# EAGLE design main (EAGLE 9.3.0)
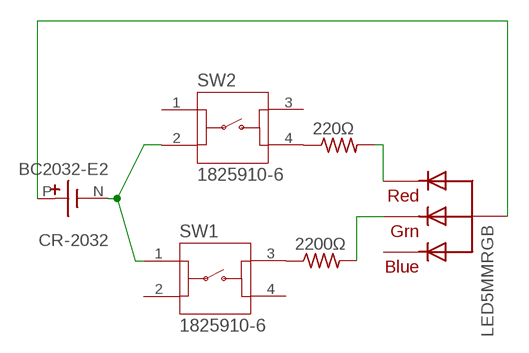
[diagram p0: schematic, sheet 1]

## Parts
220Ω  R-US_0204/5  [0204/5]
2200Ω  R-US_0204/5  [0204/5]
CR-2032  BC2032-E2  [MPD_BC2032-E2]
LED5MMRGB  RGBLED_CA-5MM  [LED5MMRGB]
SW1  1825910-6  [SW_1825910-6-4]
SW2  1825910-6  [SW_1825910-6-4]

## Nets
N$1: CR-2032.N SW1.1 SW2.2
N$2: 2200Ω.1 SW1.3
N$3: 220Ω.1 SW2.4
N$4: 2200Ω.2 LED5MMRGB.3(GREEN)
N$5: 220Ω.2 LED5MMRGB.1(RED)
N$6: CR-2032.P LED5MMRGB.2(VCC)
Unconnected: LED5MMRGB.4(BLUE) SW1.2 SW1.4 SW2.1 SW2.3

## Library data of the parts
220Ω 2200Ω = adafruit:R-US_: RESISTOR, American symbol
CR-2032 = BC2032-E2:BC2032-E2: Holder Battery Cr2032 Sony Equal; DESCRIPTION: Holder Battery Cr2032 Sony Equal; DIGI-KEY_PART_NUMBER: BC2032-E2-ND; DIGI-KEY_PURCHASE_URL: https://www.digikey.com/product-detail/en/mpd-memory-protection-devices/BC2032-E2/BC2032-E2-ND/2077836?utm_source=snapeda&utm_medium=aggregator&utm_campaign=symbol; MF: MPD _Memory; MP: BC2032-E2; PACKAGE: DFN-8 Memory Protection Devices
LED5MMRGB = adafruit:RGBLED_CA: RGB LED, common-anode 5MM Staggered pins 5mm Piranha package http://www.ladyada.net/library/pcb/eaglelibrary.html
SW1 SW2 = 1825910-6:1825910-6: Switch Tactile OFF (ON) SPST Round Button PC Pins 0.05A 24VDC 100000Cycles 1.57N Thru-Hole Loose; COMMENT: 1825910-6; CONFIGURATION_POLE-THROW: Single Pole - Single Throw; CONTACT_CURRENT_RATING: 50 mA; DESCRIPTION: FSM4JH=6MM TACT SWITCH, HIGH TEMP; DIGI-KEY_PART_NUMBER: 450-1650-ND; DIGI-KEY_PURCHASE_URL: https://www.digikey.com/product-detail/en/te-connectivity-alcoswitch-switches/1825910-6/450-1650-ND/1632536?utm_source=snapeda&utm_medium=aggregator&utm_campaign=symbol; EU_ROHS_COMPLIANCE: Compliant; MF: TE Connectivity; MP: 1825910-6; PACKAGE: None; TE_PURCHASE_URL: https://www.te.com/usa-en/product-1825910-6.html?te_bu=Cor&te_type=disp&te_campaign=seda_glo_cor-seda-global-disp-prtnr-fy19-seda-model-bom-cta_sma-317_1&elqCampaignId=32493

## Net classes
0 default: width 0.305 mm, drill 0.254 mm, clearance 0.254 mm

## Board
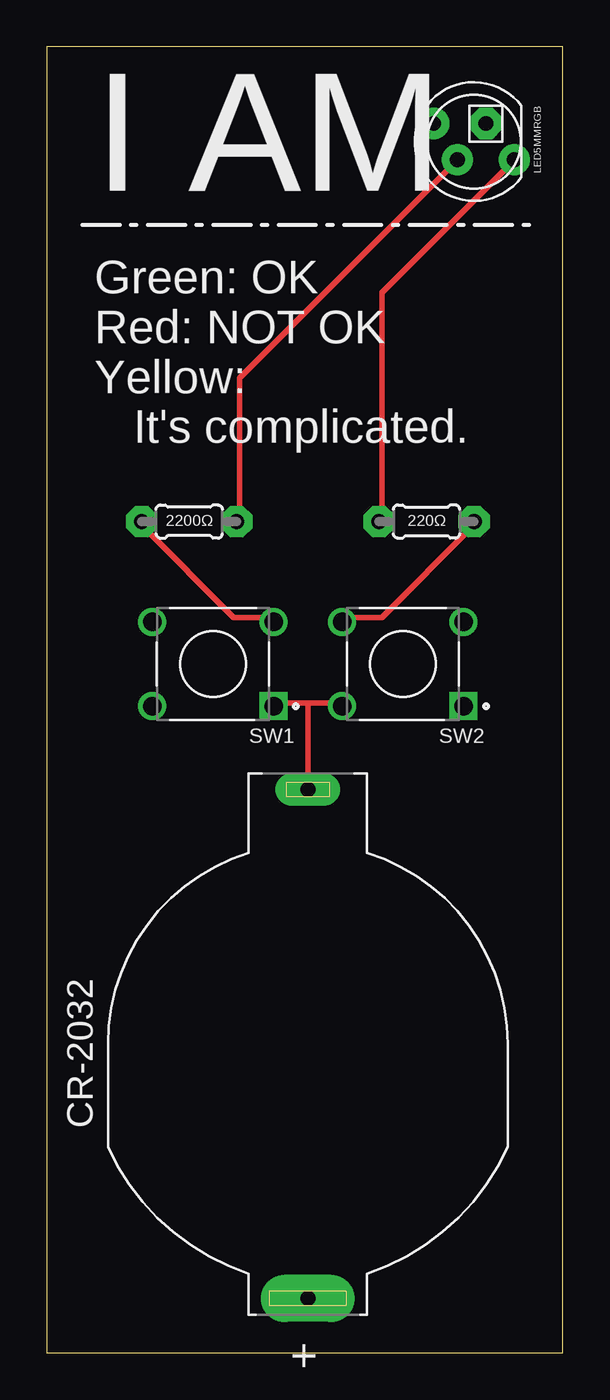
[diagram p1: board, top side]
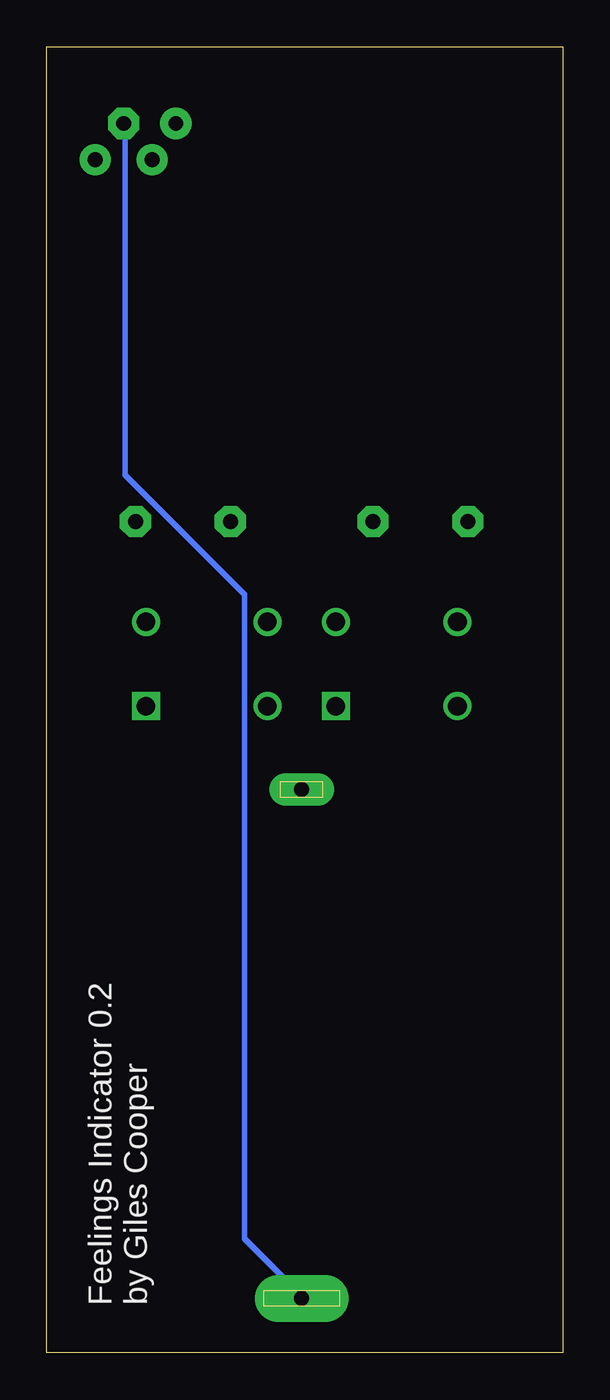
[diagram p2: board, bottom side, seen from below]

Size 27.61 x 69.84 mm. Coordinates in mm from the lower left corner, seen from the top.
Outline: 0,0 27.61,0 27.61,69.84 0,69.84 0,0
Copper layers (1*16): Top 0.035mm / dielectric 1.5mm / Bottom 0.035mm
Design rules "default": minimum track width 6mil, minimum drill 0.35mm, track to track 6mil, track to pad 6mil, pad to pad 6mil, via to via 6mil, smd to smd 6mil, copper to edge 40mil, drill to drill 6mil, minimum pad ring 10mil, minimum via ring 8mil, stop-mask expansion 4mil, vias tented up to drill 0mil, thermal gap 10mil

### Footprints (pad centres in the part's own frame; a part is rotated, then mirrored left to right if it is on the bottom)
0204/5 = drill 0.813 pad 1.676 octagon: 1 -2.54,0; 2 2.54,0
MPD_BC2032-E2 = drill 0.8 pad 1.75 long: N 13.6,0 | drill 0.8 pad 2.5 long: P -13.6,0
LED5MMRGB = drill 0.8 pad 1.676: 1 -2.159,0.968; 3 0.889,0.968; 4 2.159,-0.968 | drill 0.8 pad 1.676 octagon: 2 -0.635,-0.968
SW_1825910-6-4 = drill 0.99 square: 1 -3.25,2.25 | drill 0.99: 2 3.25,2.25; 3 -3.25,-2.25; 4 3.25,-2.25

### Placement (x,y rotation side)
220Ω  20.32,44.45 180 top
2200Ω  7.62,44.45 0 top
CR-2032  13.97,16.51 90 top
LED5MMRGB  22.86,64.77 180 top
SW1  8.89,36.83 180 top
SW2  19.05,36.83 180 top

### Tracks (layer width: path | path; a pad name or v marks a point on that pad's centre or on a via)
N$1
  Top 0.305: 13.97,34.75 15.8,34.75 SW2.2 | 13.97,34.75 12.14,34.75 SW1.1 | 13.97,34.75 CR-2032.N
N$2
  Top 0.305: SW1.3 11.84,39.32 10.01,39.32 5.13,44.2 2200Ω.1
N$3
  Top 0.305: SW2.4 16.1,39.32 17.93,39.32 22.81,44.2 220Ω.1
N$4
  Top 0.305: LED5MMRGB.3 21.89,63.7 10.31,52.12 10.31,44.5 2200Ω.2
N$5
  Top 0.305: 220Ω.2 17.93,44.5 17.93,56.69 24.94,63.7 LED5MMRGB.1
N$6
  Bottom 0.305: LED5MMRGB.2 23.42,65.53 23.42,46.94 17.02,40.54 17.02,6.1 13.97,3.05 CR-2032.P

### Text on the board
tNames: I AM | Green: OK / Red: NOT OK / Yellow: / It's complicated.
bNames: Feelings Indicator 0.2 / by Giles Cooper